# Altium project SAMV71_Xplained_Ultra.PrjPCB (part 1 of 4)
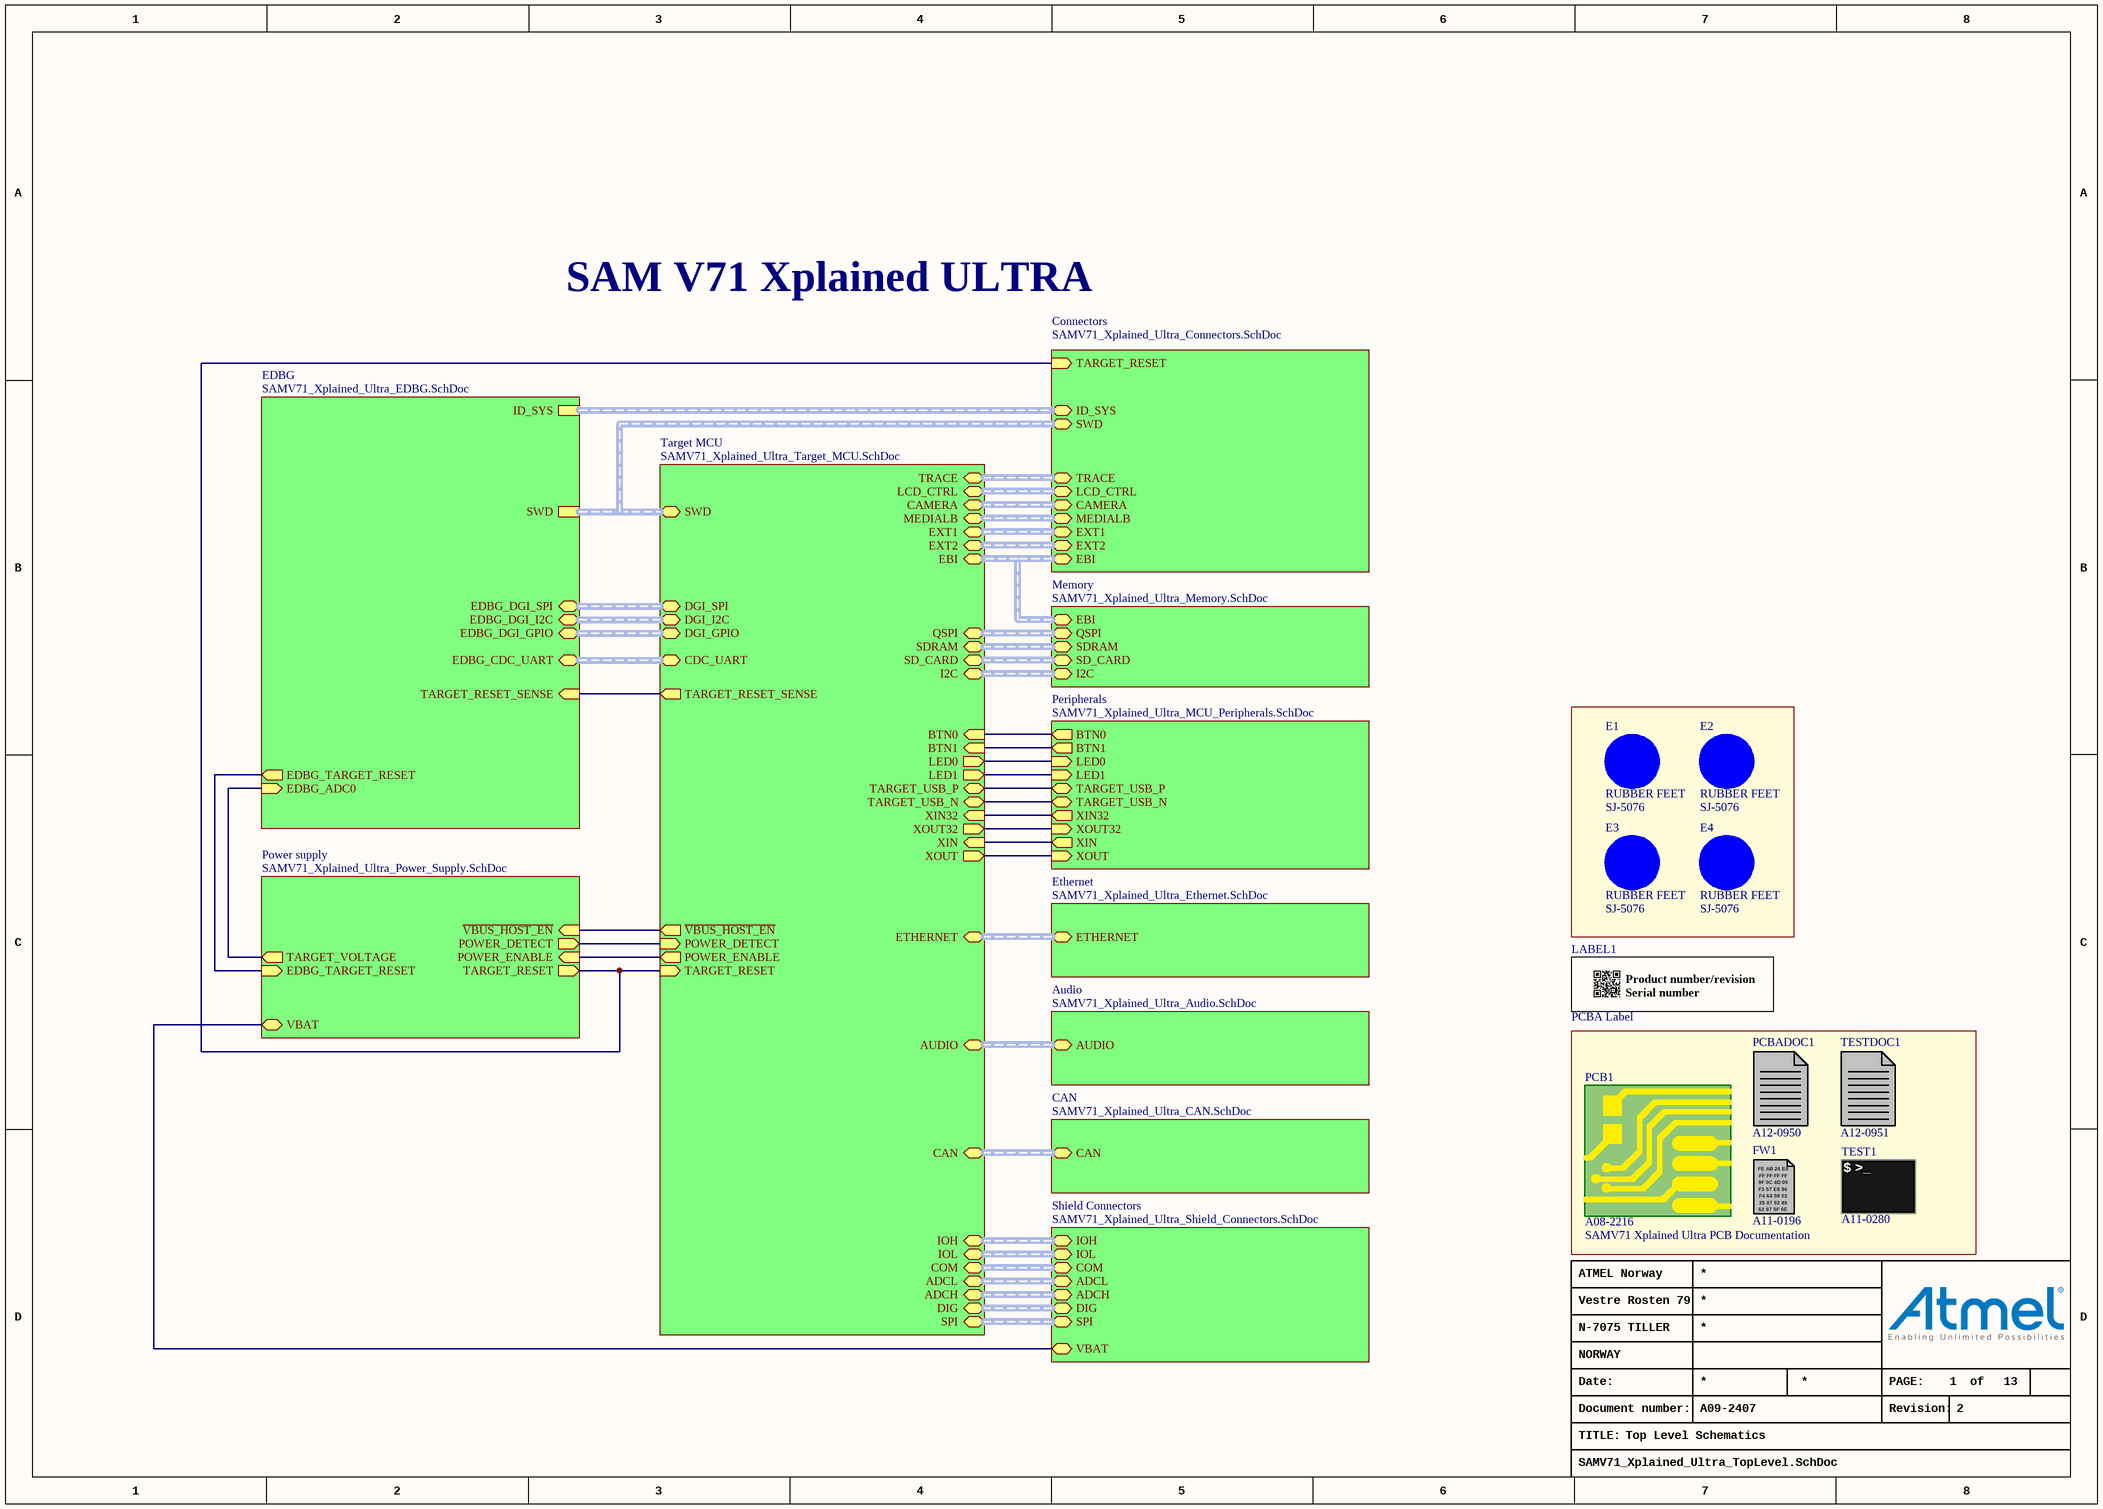
[diagram p0: SAMV71_Xplained_Ultra_TopLevel.SchDoc]
13 sheets, 396 parts. Net scope: hierarchical (ports join the sheet entries above them; power ports are global).
Board file: SAMV71_Xplained_Ultra.PcbDoc
Sheets:
  SAMV71_Xplained_Ultra_TopLevel.SchDoc
    Target MCU = SAMV71_Xplained_Ultra_Target_MCU.SchDoc
    EDBG = SAMV71_Xplained_Ultra_EDBG.SchDoc
    Connectors = SAMV71_Xplained_Ultra_Connectors.SchDoc
    Power supply = SAMV71_Xplained_Ultra_Power_Supply.SchDoc
      Power Multiplexer = SAMV71_Xplained_Ultra_Power_Multiplexer.SchDoc
      Power Converter = SAMV71_Xplained_Ultra_Power_Converter.SchDoc
    Ethernet = SAMV71_Xplained_Ultra_Ethernet.SchDoc
    Memory = SAMV71_Xplained_Ultra_Memory.SchDoc
    Shield Connectors = SAMV71_Xplained_Ultra_Shield_Connectors.SchDoc
    Audio = SAMV71_Xplained_Ultra_Audio.SchDoc
    Peripherals = SAMV71_Xplained_Ultra_MCU_Peripherals.SchDoc
    CAN = SAMV71_Xplained_Ultra_CAN.SchDoc

## Sheet SAMV71_Xplained_Ultra_TopLevel.SchDoc: Top Level Schematics
size A3; Organization: ATMEL Norway; Address1: Vestre Rosten 79; Address2: N-7075 TILLER; Address3: NORWAY; DocumentNumber: A09-2407; Revision: 2; SheetNumber: 1; SheetTotal: 13; PageSetup: Record=PageOptions|CenterHorizontal=True|CenterVertical=True|PrintScale=1.01|XCorrection=1.00|YCorrection=1.00|PrintKind=1|BorderSize=5000000|LeftOffset=0|BottomOffset=0|Orientation=2|PaperLength=1000|PaperWidth=1000|Scale=100|PaperSource=7|PrintQuality=-4|MediaType=1|DitherType=10|PaperKind=Letter|PrintScaleMode=1

### Parts
E1  RUBBER FEET  value SJ-5076  [AP8-00192]
E2  RUBBER FEET  value SJ-5076  [AP8-00192]
E3  RUBBER FEET  value SJ-5076  [AP8-00192]
E4  RUBBER FEET  value SJ-5076  [AP8-00192]
FW1  AN: A11-0196  (hidden comment: FW)  (mechanical)
LABEL1  value PCBA Label  [AP8-00317]
PCB1  value SAMV71 Xplained Ultra PCB Documentation  AN: A08-2216  (hidden comment: PCB)  (mechanical)
PCBADOC1  AN: A12-0950  (hidden comment: PCBADOC)  (mechanical)
TEST1  AN: A11-0280  (hidden comment: TEST)  (mechanical)
TESTDOC1  AN: A12-0951  (hidden comment: TESTDOC)  (mechanical)

### Sub-sheets
Audio = SAMV71_Xplained_Ultra_Audio.SchDoc: AUDIO (harness AUDIO)
CAN = SAMV71_Xplained_Ultra_CAN.SchDoc: CAN (harness CAN)
Connectors = SAMV71_Xplained_Ultra_Connectors.SchDoc: ID_SYS (harness ID_SYS), EXT1 (harness EXT1), EXT2 (harness EXT2), EBI (harness EBI), CAMERA (harness CAMERA), MEDIALB (harness MEDIALB), TRACE (harness TRACE), LCD_CTRL (harness LCD_CTRL), SWD (harness SWD), TARGET_RESET (in)
EDBG = SAMV71_Xplained_Ultra_EDBG.SchDoc: ID_SYS (harness ID_SYS), SWD (harness SWD), EDBG_CDC_UART (harness CDC_UART), EDBG_DGI_I2C (harness DGI_I2C), EDBG_DGI_SPI (harness DGI_SPI), EDBG_DGI_GPIO (harness DGI_GPIO), TARGET_RESET_SENSE (in), EDBG_ADC0 (in), EDBG_TARGET_RESET (out)
Ethernet = SAMV71_Xplained_Ultra_Ethernet.SchDoc: ETHERNET (harness ETHERNET)
Memory = SAMV71_Xplained_Ultra_Memory.SchDoc: SD_CARD (harness SD_CARD), EBI (harness EBI), QSPI (harness QSPI), SDRAM (harness SDRAM), I2C (harness I2C)
Peripherals = SAMV71_Xplained_Ultra_MCU_Peripherals.SchDoc: BTN0 (out), BTN1 (out), LED0 (in), TARGET_USB_N (bidir), TARGET_USB_P (bidir), XOUT32 (in), XIN32 (out), XIN (out), XOUT (in), LED1 (in)
Power supply = SAMV71_Xplained_Ultra_Power_Supply.SchDoc: TARGET_VOLTAGE (out), ~{VBUS_HOST_EN} (in), EDBG_TARGET_RESET (in), POWER_ENABLE (in), TARGET_RESET (out), POWER_DETECT (out), VBAT (bidir)
Shield Connectors = SAMV71_Xplained_Ultra_Shield_Connectors.SchDoc: IOH (harness IOH), IOL (harness IOL), COM (harness COM), ADCL (harness ADCL), ADCH (harness ADCH), DIG (harness DIG), SPI (harness SPI), VBAT (bidir)
Target MCU = SAMV71_Xplained_Ultra_Target_MCU.SchDoc: SWD (harness SWD), DGI_SPI (harness DGI_SPI), DGI_I2C (harness DGI_I2C), DGI_GPIO (harness DGI_GPIO), CDC_UART (harness CDC_UART), TARGET_RESET_SENSE (out), SD_CARD (harness SD_CARD), QSPI (harness QSPI), SDRAM (harness SDRAM), ETHERNET (harness ETHERNET), EXT2 (harness EXT2), EXT1 (harness EXT1), EBI (harness EBI), CAMERA (harness CAMERA), AUDIO (harness AUDIO), BTN0 (in), BTN1 (in), LED0 (out), TARGET_USB_P (bidir), XOUT32 (out), XIN32 (in), XIN (in), XOUT (out), LED1 (out), TARGET_USB_N (bidir), IOH (harness IOH), IOL (harness IOL), COM (harness COM), ADCL (harness ADCL), ADCH (harness ADCH), DIG (harness DIG), CAN (harness CAN), ~{VBUS_HOST_EN} (out), I2C (harness I2C), TARGET_RESET (in), POWER_ENABLE (out), TRACE (harness TRACE), LCD_CTRL (harness LCD_CTRL), MEDIALB (harness MEDIALB), SPI (harness SPI), POWER_DETECT (in)

### Nets
EDBG_ADC0: sheet EDBG/EDBG_ADC0, sheet Power supply/TARGET_VOLTAGE
EDBG_TARGET_RESET: sheet EDBG/EDBG_TARGET_RESET, sheet Power supply/EDBG_TARGET_RESET
PA01: sheet Target MCU/POWER_DETECT, sheet Power supply/POWER_DETECT
PA07_XIN32: sheet Target MCU/XIN32, sheet Peripherals/XIN32
PA08_XOUT32: sheet Target MCU/XOUT32, sheet Peripherals/XOUT32
PA09: sheet Target MCU/BTN0, sheet Peripherals/BTN0
PA23: sheet Target MCU/LED0, sheet Peripherals/LED0
PB08_XOUT: sheet Target MCU/XOUT, sheet Peripherals/XOUT
PB09_XIN: sheet Target MCU/XIN, sheet Peripherals/XIN
PB12: sheet Target MCU/BTN1, sheet Peripherals/BTN1
PC09: sheet Target MCU/LED1, sheet Peripherals/LED1
PC16: sheet Target MCU/~{VBUS_HOST_EN}, sheet Power supply/~{VBUS_HOST_EN}
PC17: sheet Target MCU/POWER_ENABLE, sheet Power supply/POWER_ENABLE
TARGET_RESET: sheet Target MCU/TARGET_RESET_SENSE, sheet Target MCU/TARGET_RESET, sheet EDBG/TARGET_RESET_SENSE, sheet Connectors/TARGET_RESET, sheet Power supply/TARGET_RESET
TARGET_USB_N: sheet Target MCU/TARGET_USB_N, sheet Peripherals/TARGET_USB_N
TARGET_USB_P: sheet Target MCU/TARGET_USB_P, sheet Peripherals/TARGET_USB_P
VBAT: sheet Power supply/VBAT, sheet Shield Connectors/VBAT

Not connected (* = marked no-connect by the designer): E1 1(FIDUCIAL); E2 1(FIDUCIAL); E3 1(FIDUCIAL); E4 1(FIDUCIAL)

### Buses and harness runs
harness sheet Audio/AUDIO = sheet Target MCU/AUDIO
harness sheet CAN/CAN = sheet Target MCU/CAN
harness sheet Connectors/CAMERA = sheet Target MCU/CAMERA
harness sheet Connectors/EBI = sheet Memory/EBI = sheet Target MCU/EBI
harness sheet Connectors/EXT1 = sheet Target MCU/EXT1
harness sheet Connectors/EXT2 = sheet Target MCU/EXT2
harness sheet Connectors/ID_SYS = sheet EDBG/ID_SYS
harness sheet Connectors/LCD_CTRL = sheet Target MCU/LCD_CTRL
harness sheet Connectors/MEDIALB = sheet Target MCU/MEDIALB
harness sheet Connectors/SWD = sheet EDBG/SWD = sheet Target MCU/SWD
harness sheet Connectors/TRACE = sheet Target MCU/TRACE
harness sheet EDBG/EDBG_CDC_UART = sheet Target MCU/CDC_UART
harness sheet EDBG/EDBG_DGI_GPIO = sheet Target MCU/DGI_GPIO
harness sheet EDBG/EDBG_DGI_I2C = sheet Target MCU/DGI_I2C
harness sheet EDBG/EDBG_DGI_SPI = sheet Target MCU/DGI_SPI
harness sheet Ethernet/ETHERNET = sheet Target MCU/ETHERNET
harness sheet Memory/I2C = sheet Target MCU/I2C
harness sheet Memory/QSPI = sheet Target MCU/QSPI
harness sheet Memory/SD_CARD = sheet Target MCU/SD_CARD
harness sheet Memory/SDRAM = sheet Target MCU/SDRAM
harness sheet Shield Connectors/ADCH = sheet Target MCU/ADCH
harness sheet Shield Connectors/ADCL = sheet Target MCU/ADCL
harness sheet Shield Connectors/COM = sheet Target MCU/COM
harness sheet Shield Connectors/DIG = sheet Target MCU/DIG
harness sheet Shield Connectors/IOH = sheet Target MCU/IOH
harness sheet Shield Connectors/IOL = sheet Target MCU/IOL
harness sheet Shield Connectors/SPI = sheet Target MCU/SPI

### Notes on the sheet
- SAM V71 Xplained ULTRA
- Date:
- PAGE:
- of
- TITLE:
- Document number:
- Revision:
- (in symbol A09-0611) / Product number/revision / Serial number
- (in symbol A11-0196) FE AB 26 E0; FF FF FF FF; 9F 0C 4D 00; F3 57 E8 96; F4 64 98 02; 35 07 92 86; 62 87 5F 0E
- (in symbol A11-0280) $ >_

### Library data of the parts
E1-E4 = A08-0053: 2.8mm adhesive feet,diam 8.0mm; PartGroup: Mechanical devices,Mounting accessories; Manufacturer: 3M; AN: A08-0053; Height: 2,79999995231628; MPN: SJ-5076
FW1 = A11-0196: EDBG secured firmware; PartGroup: Software,Firmware,Tools; Manufacturer: ATMEL; Value: EDBG secured firmware
LABEL1 = A09-0611: PCBA identification label PP Top White Gloss; PartGroup: Mechanical devices,Packaging materials,Printed Labels; Manufacturer: ACT Logimark AS; MPN: 505462; AN: A09-0611
PCB1 = A08-2216: SAMV7 Xplained Ultra PCB Documentation; PartGroup: Mechanical devices,Printed circuit boards
PCBADOC1 = A12-0950: SAMV7 Xplained pro PCBA Documentation; PartGroup: Documentation,PCBA Documents,Atmel; Value: SAMV7 Xplained pro PCBA Documentation
TEST1 = A11-0280: Fixture eggTest for SAMV7 Xplained Ultra; PartGroup: Software,Test software,Starter Kit; Value: SAMV7 Xplained Ultra Test
TESTDOC1 = A12-0951: SAMV7 Xplained Pro Test Instructions; PartGroup: Documentation,Procedures,Test Instructions; Value: SAMV7 Xplained Pro Test Instructions

## Sheet SAMV71_Xplained_Ultra_Target_MCU.SchDoc: Target MCU
size A3; Organization: ATMEL Norway; Address1: Vestre Rosten 79; Address2: N-7075 TILLER; Address3: NORWAY; DocumentNumber: A09-2407; Revision: 2; SheetNumber: 5; SheetTotal: 13; PageSetup: Record=PageOptions|CenterHorizontal=True|CenterVertical=True|PrintScale=1.01|XCorrection=1.00|YCorrection=1.00|PrintKind=1|BorderSize=5000000|LeftOffset=0|BottomOffset=0|Orientation=2|PaperLength=1000|PaperWidth=1000|Scale=100|PaperSource=7|PrintQuality=-4|MediaType=1|DitherType=10|PaperKind=A3 (297 x 420 mm)|PrintScaleMode=1
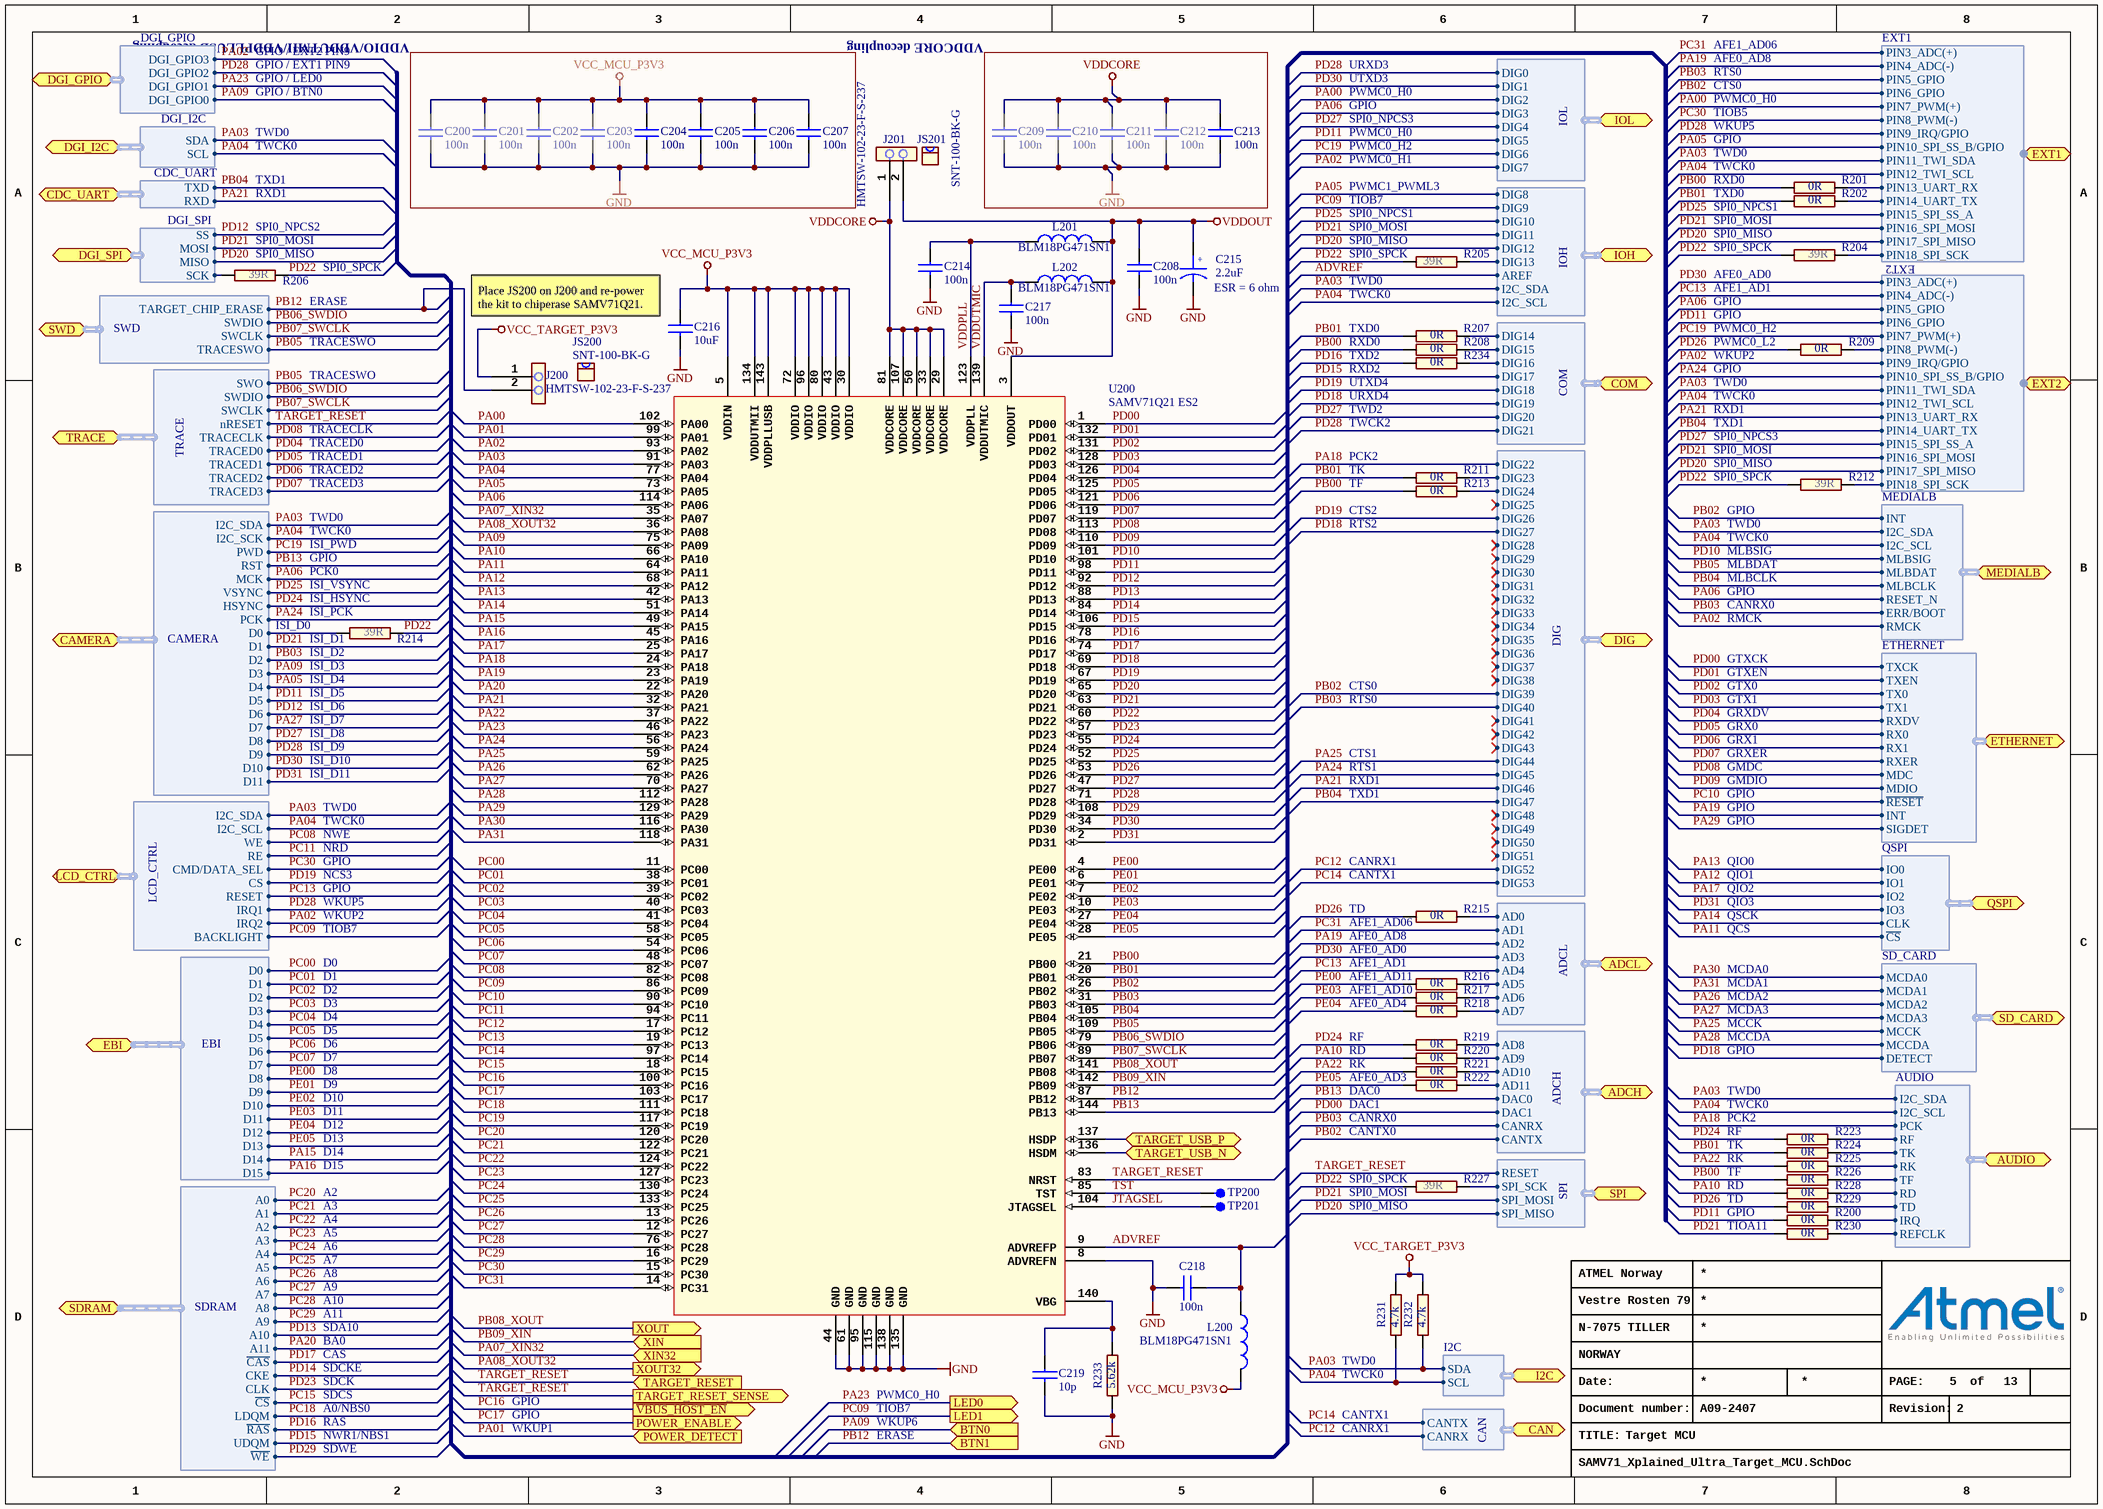
[diagram p1: SAMV71_Xplained_Ultra_Target_MCU.SchDoc]

### Parts
C200  value 100n  [AP1-00001]  (hidden comment: CAP-NONPOL)
C201  value 100n  [AP1-00001]  (hidden comment: CAP-NONPOL)
C202  value 100n  [AP1-00001]  (hidden comment: CAP-NONPOL)
C203  value 100n  [AP1-00001]  (hidden comment: CAP-NONPOL)
C204  value 100n  [AP1-00001]  (hidden comment: CAP-NONPOL)
C205  value 100n  [AP1-00001]  (hidden comment: CAP-NONPOL)
C206  value 100n  [AP1-00001]  (hidden comment: CAP-NONPOL)
C207  value 100n  [AP1-00001]  (hidden comment: CAP-NONPOL)
C208  value 100n  [AP1-00001]  (hidden comment: CAP-NONPOL)
C209  value 100n  [AP1-00001]  (hidden comment: CAP-NONPOL)
C210  value 100n  [AP1-00001]  (hidden comment: CAP-NONPOL)
C211  value 100n  [AP1-00001]  (hidden comment: CAP-NONPOL)
C212  value 100n  [AP1-00001]  (hidden comment: CAP-NONPOL)
C213  value 100n  [AP1-00001]  (hidden comment: CAP-NONPOL)
C214  value 100n  [AP1-00001]  (hidden comment: CAP-NONPOL)
C215  ESR = 6 ohm  value 2.2uF  [AP1-00036]
C216  value 10uF  [AP1-00041]  (hidden comment: CAP-NONPOL)
C217  value 100n  [AP1-00001]  (hidden comment: CAP-NONPOL)
C218  value 100n  [AP1-00001]  (hidden comment: CAP-NONPOL)
C219  10p  [AP1-00053]
J200  value HMTSW-102-23-F-S-237  [AP8-00733]  (hidden comment: HEADER 1x2)
J201  value HMTSW-102-23-F-S-237  [AP8-00733]  (hidden comment: HEADER 1x2)
JS200  value SNT-100-BK-G  [AP8-00525]
JS201  value SNT-100-BK-G  [AP8-00525]
L200  value BLM18PG471SN1  [AP3-00005]  (hidden comment: INDUCTOR)
L201  value BLM18PG471SN1  [AP3-00005]  (hidden comment: INDUCTOR)
L202  value BLM18PG471SN1  [AP3-00005]  (hidden comment: INDUCTOR)
R200  value 0R  [AP2-00000]  (hidden comment: R2)
R201  value 0R  [AP2-00000]  (hidden comment: R2)
R202  value 0R  [AP2-00000]  (hidden comment: R2)
R204  value 39R  [AP2-00000]  (hidden comment: R2)
R205  value 39R  [AP2-00000]  (hidden comment: R2)
R206  value 39R  [AP2-00000]  (hidden comment: R2)
R207  value 0R  [AP2-00000]  (hidden comment: R2)
R208  value 0R  [AP2-00000]  (hidden comment: R2)
R209  value 0R  [AP2-00000]  (hidden comment: R2)
R211  value 0R  [AP2-00000]  (hidden comment: R2)
R212  value 39R  [AP2-00000]  (hidden comment: R2)
R213  value 0R  [AP2-00000]  (hidden comment: R2)
R214  value 39R  [AP2-00000]  (hidden comment: R2)
R215  value 0R  [AP2-00000]  (hidden comment: R2)
R216  value 0R  [AP2-00000]  (hidden comment: R2)
R217  value 0R  [AP2-00000]  (hidden comment: R2)
R218  value 0R  [AP2-00000]  (hidden comment: R2)
R219  value 0R  [AP2-00000]  (hidden comment: R2)
R220  value 0R  [AP2-00000]  (hidden comment: R2)
R221  value 0R  [AP2-00000]  (hidden comment: R2)
R222  value 0R  [AP2-00000]  (hidden comment: R2)
R223  value 0R  [AP2-00000]  (hidden comment: R2)
R224  value 0R  [AP2-00000]  (hidden comment: R2)
R225  value 0R  [AP2-00000]  (hidden comment: R2)
R226  value 0R  [AP2-00000]  (hidden comment: R2)
R227  value 39R  [AP2-00000]  (hidden comment: R2)
R228  value 0R  [AP2-00000]  (hidden comment: R2)
R229  value 0R  [AP2-00000]  (hidden comment: R2)
R230  value 0R  [AP2-00000]  (hidden comment: R2)
R231  value 4.7k  [AP2-00000]  (hidden comment: R2)
R232  value 4.7k  [AP2-00000]  (hidden comment: R2)
R233  value 5.62k  [AP2-00000]  (hidden comment: R2)
R234  value 0R  [AP2-00000]  (hidden comment: R2)
TP200  TESTPOINT  [AP8-00010]  (value not drawn)  (no BOM)
TP201  TESTPOINT  [AP8-00010]  (value not drawn)  (no BOM)
U200  value SAMV71Q21 ES2  [AP6-00118]

### Blocks framed on the sheet
VDDIO/VDDUTMII/VDDPLLUSB decoupling: C200-C207
VDDCORE decoupling: C209-C213

### Ports
ADCH (harness ADCH), ADCL (harness ADCL), AUDIO (harness AUDIO), BTN0 (in), BTN1 (in), CAMERA (harness CAMERA), CAN (harness CAN), CDC_UART (harness CDC_UART), COM (harness COM), DGI_GPIO (harness DGI_GPIO), DGI_I2C (harness DGI_I2C), DGI_SPI (harness DGI_SPI), DIG (harness DIG), EBI (harness EBI), ETHERNET (harness ETHERNET), EXT1 (harness EXT1), EXT2 (harness EXT2), I2C (harness I2C), IOH (harness IOH), IOL (harness IOL), LCD_CTRL (harness LCD_CTRL), LED0 (out), LED1 (out), MEDIALB (harness MEDIALB), POWER_DETECT (in), POWER_ENABLE (out), QSPI (harness QSPI), SD_CARD (harness SD_CARD), SDRAM (harness SDRAM), SPI (harness SPI), SWD (harness SWD), TARGET_RESET (in), TARGET_RESET_SENSE (out), TARGET_USB_N (bidir), TARGET_USB_P (bidir), TRACE (harness TRACE), XIN32 (in), XIN (in), XOUT32 (out), XOUT (out), ~{VBUS_HOST_EN} (out)

### Harnesses
SWD: SWCLK, SWDIO, TARGET_CHIP_ERASE, TRACESWO
DGI_GPIO: DGI_GPIO0, DGI_GPIO1, DGI_GPIO2, DGI_GPIO3
DGI_SPI: MISO, MOSI, SCK, SS
DGI_I2C: SCL, SDA
CDC_UART: RXD, TXD
EXT1: PIN10_SPI_SS_B/GPIO, PIN11_TWI_SDA, PIN12_TWI_SCL, PIN13_UART_RX, PIN14_UART_TX, PIN15_SPI_SS_A, PIN16_SPI_MOSI, PIN17_SPI_MISO, PIN18_SPI_SCK, PIN3_ADC(+), PIN4_ADC(-), PIN5_GPIO, PIN6_GPIO, PIN7_PWM(+), PIN8_PWM(-), PIN9_IRQ/GPIO
EXT2: PIN10_SPI_SS_B/GPIO, PIN11_TWI_SDA, PIN12_TWI_SCL, PIN13_UART_RX, PIN14_UART_TX, PIN15_SPI_SS_A, PIN16_SPI_MOSI, PIN17_SPI_MISO, PIN18_SPI_SCK, PIN3_ADC(+), PIN4_ADC(-), PIN5_GPIO, PIN6_GPIO, PIN7_PWM(+), PIN8_PWM(-), PIN9_IRQ/GPIO
EBI: D0, D1, D2, D3, D4, D5, D6, D7, D8, D9, D10, D11, D12, D13, D14, D15
CAMERA: MCK, VSYNC, HSYNC, PCK, D0, D1, D2, D3, D4, D5, D6, D7, D8, D9, D10, D11, I2C_SCK, I2C_SDA, RST, PWD
ETHERNET: TX0, TX1, TXEN, TXCK, RX0, RX1, MDC, MDIO, RXER, RXDV, INT, ~{RESET}, SIGDET
QSPI: CLK, IO3, IO2, IO0, IO1, ~{CS}
SDRAM: ~{CAS}, ~{RAS}, ~{CS}, CLK, CKE, ~{WE}, LDQM, UDQM, A0, A1, A2, A3, A4, A5, A6, A7, A8, A9, A10, A11
SD_CARD: MCCDA, MCCK, MCDA3, MCDA2, MCDA1, MCDA0, DETECT
AUDIO: I2C_SDA, I2C_SCL, PCK, TK, RK, TF, RD, TD, IRQ, REFCLK, RF
ADCL: AD0, AD1, AD2, AD3, AD4, AD5, AD6, AD7
ADCH: AD8, AD9, AD10, AD11, DAC0, DAC1, CANRX, CANTX
DIG: DIG22, DIG23, DIG24, DIG25, DIG26, DIG27, DIG28, DIG29, DIG30, DIG31, DIG32, DIG33, DIG34, DIG35, DIG36, DIG37, DIG38, DIG39, DIG40, DIG41, DIG42, DIG43, DIG44, DIG45, DIG46, DIG47, DIG48, DIG49, DIG50, DIG51, DIG52, DIG53
CAN: CANTX, CANRX
I2C: SDA, SCL
LCD_CTRL: CMD/DATA_SEL, CS, WE, RE, I2C_SDA, I2C_SCL, IRQ1, IRQ2, BACKLIGHT, RESET
SPI: SPI_MISO, SPI_MOSI, SPI_SCK, RESET
TRACE: SWDIO, SWCLK, TRACECLK, TRACED0, TRACED1, TRACED2, TRACED3, nRESET, SWO
MEDIALB: MLBSIG, MLBDAT, MLBCLK, I2C_SDA, I2C_SCL, INT, ERR/BOOT, RESET_N, RMCK
COM: DIG14, DIG15, DIG16, DIG17, DIG18, DIG19, DIG20, DIG21
IOH: DIG8, DIG9, DIG10, DIG11, DIG12, DIG13, AREF, I2C_SCL, I2C_SDA
IOL: DIG0, DIG1, DIG2, DIG3, DIG4, DIG5, DIG6, DIG7

### Nets
GND: C200.2 C201.2 C202.2 C203.2 C204.2 C205.2 C206.2 C207.2 C208.2 C209.2 C210.2 C211.2 C212.2 C213.2 C214.2 C215.2 C216.2 C217.2 C218.2 C219.2 R233.1 U200.8(ADVREFN) U200.44(GND) U200.61(GND) U200.95(GND) U200.115(GND) U200.135(GND) U200.138(GND)
VCC_MCU_P3V3: C200.1 C201.1 C202.1 C203.1 C204.1 C205.1 C206.1 C207.1 C216.1 L200.1 U200.5(VDDIN) U200.30(VDDIO) U200.43(VDDIO) U200.72(VDDIO) U200.80(VDDIO) U200.96(VDDIO) U200.134(VDDUTMII) U200.143(VDDPLLUSB)
VCC_TARGET_P3V3: J200.1 R231.1 R232.1
VDDCORE: C209.1 C210.1 C211.1 C212.1 C213.1 J201.1 U200.29(VDDCORE) U200.33(VDDCORE) U200.50(VDDCORE) U200.81(VDDCORE) U200.107(VDDCORE)
VDDOUT: C208.1 C215.1 J201.2 L201.1 L202.1 U200.3(VDDOUT)
ADVREF: C218.1 L200.2 U200.9(ADVREFP) ; port IOH.AREF
JTAGSEL: TP201.1 U200.104(JTAGSEL)
PA00: U200.102(PA00) ; port EXT1.PIN7_PWM(+), port IOL.DIG2
PA01: U200.99(PA01) ; port POWER_DETECT
PA02: U200.93(PA02) ; port DGI_GPIO.DGI_GPIO3, port EXT2.PIN9_IRQ/GPIO, port LCD_CTRL.IRQ2, port MEDIALB.RMCK, port IOL.DIG7
PA03: R232.2 U200.91(PA03) ; port DGI_I2C.SDA, port EXT1.PIN11_TWI_SDA, port EXT2.PIN11_TWI_SDA, port CAMERA.I2C_SDA, port AUDIO.I2C_SDA, port I2C.SDA, port LCD_CTRL.I2C_SDA, port MEDIALB.I2C_SDA, port IOH.I2C_SDA
PA04: R231.2 U200.77(PA04) ; port DGI_I2C.SCL, port EXT1.PIN12_TWI_SCL, port EXT2.PIN12_TWI_SCL, port CAMERA.I2C_SCK, port AUDIO.I2C_SCL, port I2C.SCL, port LCD_CTRL.I2C_SCL, port MEDIALB.I2C_SCL, port IOH.I2C_SCL
PA05: U200.73(PA05) ; port EXT1.PIN10_SPI_SS_B/GPIO, port CAMERA.D4, port IOH.DIG8
PA06: U200.114(PA06) ; port EXT2.PIN5_GPIO, port CAMERA.MCK, port MEDIALB.RESET_N, port IOL.DIG3
PA07_XIN32: U200.35(PA07) ; port XIN32
PA08_XOUT32: U200.36(PA08) ; port XOUT32
PA09: U200.75(PA09) ; port BTN0, port DGI_GPIO.DGI_GPIO0, port CAMERA.D3
PA10: R220.1 R228.1 U200.66(PA10)
PA11: U200.64(PA11) ; port QSPI.~{CS}
PA12: U200.68(PA12) ; port QSPI.IO1
PA13: U200.42(PA13) ; port QSPI.IO0
PA14: U200.51(PA14) ; port QSPI.CLK
PA15: U200.49(PA15) ; port EBI.D14
PA16: U200.45(PA16) ; port EBI.D15
PA17: U200.25(PA17) ; port QSPI.IO2
PA18: U200.24(PA18) ; port AUDIO.PCK, port DIG.DIG22
PA19: U200.23(PA19) ; port EXT1.PIN4_ADC(-), port ETHERNET.INT, port ADCL.AD2
PA20: U200.22(PA20) ; port SDRAM.A11
PA21: U200.32(PA21) ; port CDC_UART.RXD, port EXT2.PIN13_UART_RX, port DIG.DIG46
PA22: R221.1 R225.1 U200.37(PA22)
PA23: U200.46(PA23) ; port LED0, port DGI_GPIO.DGI_GPIO1
PA24: U200.56(PA24) ; port EXT2.PIN10_SPI_SS_B/GPIO, port CAMERA.PCK, port DIG.DIG45
PA25: U200.59(PA25) ; port SD_CARD.MCCK, port DIG.DIG44
PA26: U200.62(PA26) ; port SD_CARD.MCDA2
PA27: U200.70(PA27) ; port CAMERA.D7, port SD_CARD.MCDA3
PA28: U200.112(PA28) ; port SD_CARD.MCCDA
PA29: U200.129(PA29) ; port ETHERNET.SIGDET
PA30: U200.116(PA30) ; port SD_CARD.MCDA0
PA31: U200.118(PA31) ; port SD_CARD.MCDA1
PB00: R201.1 R208.1 R213.1 R226.1 U200.21(PB00)
PB01: R202.1 R207.1 R211.1 R224.1 U200.20(PB01)
PB02: U200.26(PB02) ; port EXT1.PIN6_GPIO, port ADCH.CANTX, port DIG.DIG39, port MEDIALB.INT
PB03: U200.31(PB03) ; port EXT1.PIN5_GPIO, port CAMERA.D2, port ADCH.CANRX, port DIG.DIG40, port MEDIALB.ERR/BOOT
PB04: U200.105(PB04) ; port CDC_UART.TXD, port EXT2.PIN14_UART_TX, port DIG.DIG47, port MEDIALB.MLBCLK
PB05: U200.109(PB05) ; port SWD.TRACESWO, port TRACE.SWO, port MEDIALB.MLBDAT
PB06_SWDIO: U200.79(PB06) ; port SWD.SWDIO, port TRACE.SWDIO
PB07_SWCLK: U200.89(PB07) ; port SWD.SWCLK, port TRACE.SWCLK
PB08_XOUT: U200.141(PB08) ; port XOUT
PB09_XIN: U200.142(PB09) ; port XIN
PB12: J200.2 U200.87(PB12) ; port BTN1, port SWD.TARGET_CHIP_ERASE
PB13: U200.144(PB13) ; port CAMERA.RST, port ADCH.DAC0
PC00: U200.11(PC00) ; port EBI.D0
PC01: U200.38(PC01) ; port EBI.D1
PC02: U200.39(PC02) ; port EBI.D2
PC03: U200.40(PC03) ; port EBI.D3
PC04: U200.41(PC04) ; port EBI.D4
PC05: U200.58(PC05) ; port EBI.D5
PC06: U200.54(PC06) ; port EBI.D6
PC07: U200.48(PC07) ; port EBI.D7
PC08: U200.82(PC08) ; port LCD_CTRL.WE
PC09: U200.86(PC09) ; port LED1, port LCD_CTRL.BACKLIGHT, port IOH.DIG9
PC10: U200.90(PC10) ; port ETHERNET.~{RESET}  [project net ~{PHY_RESET}]
PC11: U200.94(PC11) ; port LCD_CTRL.RE
PC12: U200.17(PC12) ; port DIG.DIG52, port CAN.CANRX
PC13: U200.19(PC13) ; port EXT2.PIN4_ADC(-), port ADCL.AD4, port LCD_CTRL.RESET
PC14: U200.97(PC14) ; port DIG.DIG53, port CAN.CANTX
PC15: U200.18(PC15) ; port SDRAM.~{CS}
PC16: U200.100(PC16) ; port ~{VBUS_HOST_EN}
PC17: U200.103(PC17) ; port POWER_ENABLE
PC18: U200.111(PC18) ; port SDRAM.LDQM
PC19: U200.117(PC19) ; port EXT2.PIN7_PWM(+), port CAMERA.PWD, port IOL.DIG6
PC20: U200.120(PC20) ; port SDRAM.A0
PC21: U200.122(PC21) ; port SDRAM.A1
PC22: U200.124(PC22) ; port SDRAM.A2
PC23: U200.127(PC23) ; port SDRAM.A3
PC24: U200.130(PC24) ; port SDRAM.A4
PC25: U200.133(PC25) ; port SDRAM.A5
PC26: U200.13(PC26) ; port SDRAM.A6
PC27: U200.12(PC27) ; port SDRAM.A7
PC28: U200.76(PC28) ; port SDRAM.A8
PC29: U200.16(PC29) ; port SDRAM.A9
PC30: U200.15(PC30) ; port EXT1.PIN8_PWM(-), port LCD_CTRL.CMD/DATA_SEL
PC31: U200.14(PC31) ; port EXT1.PIN3_ADC(+), port ADCL.AD1
PD00: U200.1(PD00) ; port ETHERNET.TXCK, port ADCH.DAC1
PD01: U200.132(PD01) ; port ETHERNET.TXEN
PD02: U200.131(PD02) ; port ETHERNET.TX0
PD03: U200.128(PD03) ; port ETHERNET.TX1
PD04: U200.126(PD04) ; port ETHERNET.RXDV, port TRACE.TRACED0
PD05: U200.125(PD05) ; port ETHERNET.RX0, port TRACE.TRACED1
PD06: U200.121(PD06) ; port ETHERNET.RX1, port TRACE.TRACED2
PD07: U200.119(PD07) ; port ETHERNET.RXER, port TRACE.TRACED3
PD08: U200.113(PD08) ; port ETHERNET.MDC, port TRACE.TRACECLK
PD09: U200.110(PD09) ; port ETHERNET.MDIO
PD10: U200.101(PD10) ; port MEDIALB.MLBSIG
PD11: R200.1 U200.98(PD11) ; port EXT2.PIN6_GPIO, port CAMERA.D5, port IOL.DIG5
PD12: U200.92(PD12) ; port DGI_SPI.SS, port CAMERA.D6
PD13: U200.88(PD13) ; port SDRAM.A10
PD14: U200.84(PD14) ; port SDRAM.CKE
PD15: U200.106(PD15) ; port SDRAM.UDQM, port COM.DIG17
PD16: R234.1 U200.78(PD16) ; port SDRAM.~{RAS}
PD17: U200.74(PD17) ; port SDRAM.~{CAS}
PD18: U200.69(PD18) ; port SD_CARD.DETECT, port DIG.DIG27, port COM.DIG19
PD19: U200.67(PD19) ; port DIG.DIG26, port LCD_CTRL.CS, port COM.DIG18
PD20: U200.65(PD20) ; port DGI_SPI.MISO, port EXT1.PIN17_SPI_MISO, port EXT2.PIN17_SPI_MISO, port SPI.SPI_MISO, port IOH.DIG12
PD21: R230.1 U200.63(PD21) ; port DGI_SPI.MOSI, port EXT1.PIN16_SPI_MOSI, port EXT2.PIN16_SPI_MOSI, port CAMERA.D1, port SPI.SPI_MOSI, port IOH.DIG11
PD22: R204.1 R205.1 R206.2 R212.1 R214.2 R227.1 U200.60(PD22)
PD23: U200.57(PD23) ; port SDRAM.CLK
PD24: R219.1 R223.1 U200.55(PD24) ; port CAMERA.HSYNC
PD25: U200.52(PD25) ; port EXT1.PIN15_SPI_SS_A, port CAMERA.VSYNC, port IOH.DIG10
PD26: R209.1 R215.1 R229.1 U200.53(PD26)
PD27: U200.47(PD27) ; port EXT2.PIN15_SPI_SS_A, port CAMERA.D8, port COM.DIG20, port IOL.DIG4
PD28: U200.71(PD28) ; port DGI_GPIO.DGI_GPIO2, port EXT1.PIN9_IRQ/GPIO, port CAMERA.D9, port LCD_CTRL.IRQ1, port COM.DIG21, port IOL.DIG0
PD29: U200.108(PD29) ; port SDRAM.~{WE}
PD30: U200.34(PD30) ; port EXT2.PIN3_ADC(+), port CAMERA.D10, port ADCL.AD3, port IOL.DIG1
PD31: U200.2(PD31) ; port CAMERA.D11, port QSPI.IO3
PE00: R216.1 U200.4(PE00) ; port EBI.D8
PE01: U200.6(PE01) ; port EBI.D9
PE02: U200.7(PE02) ; port EBI.D10
PE03: R217.1 U200.10(PE03) ; port EBI.D11
PE04: R218.1 U200.27(PE04) ; port EBI.D12
PE05: R222.1 U200.28(PE05) ; port EBI.D13
TARGET_RESET: U200.83(NRST) ; port TARGET_RESET_SENSE, port TARGET_RESET, port SPI.RESET, port TRACE.nRESET
TARGET_USB_N: U200.136(HSDM) ; port TARGET_USB_N
TARGET_USB_P: U200.137(HSDP) ; port TARGET_USB_P
TST: TP200.1 U200.85(TST)
VDDPLL: C214.1 L201.2 U200.123(VDDPLL)
VDDUTMIC: C217.1 L202.2 U200.139(VDDUTMIC)
NetC219_1: C219.1 R233.2 U200.140(VBG)
NetJ400_18: R214.1 ; port CAMERA.D0
NetJ401_13: R201.2 ; port EXT1.PIN13_UART_RX
NetJ401_14: R202.2 ; port EXT1.PIN14_UART_TX
NetJ401_18: R204.2 ; port EXT1.PIN18_SPI_SCK
NetJ402_8: R209.2 ; port EXT2.PIN8_PWM(-)
NetJ402_18: R212.2 ; port EXT2.PIN18_SPI_SCK
NetJ500_6: R205.2 ; port IOH.DIG13
NetJ502_1: R215.2 ; port ADCL.AD0
NetJ502_6: R216.2 ; port ADCL.AD5
NetJ502_7: R217.2 ; port ADCL.AD6
NetJ502_8: R218.2 ; port ADCL.AD7
NetJ504_1: R219.2 ; port ADCH.AD8
NetJ504_2: R220.2 ; port ADCH.AD9
NetJ504_3: R221.2 ; port ADCH.AD10
NetJ504_4: R222.2 ; port ADCH.AD11
NetJ505_6: R234.2 ; port COM.DIG16
NetJ505_7: R208.2 ; port COM.DIG15
NetJ505_8: R207.2 ; port COM.DIG14
NetJ506_3: R227.2 ; port SPI.SPI_SCK
NetJ507_4: R211.2 ; port DIG.DIG23
NetJ507_5: R213.2 ; port DIG.DIG24
NetR200_2: R200.2 ; port AUDIO.IRQ
NetR206_1: R206.1 ; port DGI_SPI.SCK
NetR223_2: R223.2 R226.2 ; port AUDIO.TF, port AUDIO.RF
NetR224_2: R224.2 ; port AUDIO.TK
NetR225_2: R225.2 ; port AUDIO.RK
NetR228_2: R228.2 ; port AUDIO.RD
NetR229_2: R229.2 ; port AUDIO.TD
NetR230_2: R230.2 ; port AUDIO.REFCLK

### Notes on the sheet
- AFE1_AD06
- GPIO / BTN0
- GPIO / LED0
- GPIO / EXT2 PIN9
- GPIO / EXT1 PIN9
- PWMC0_H0
- GPIO
- URXD3
- UTXD3
- RTS0
- CTS0
- AFE0_AD8
- TWCK0
- TWD0
- TXD1
- SPI0_NPCS3
- PWMC0_H2
- PWMC0_H1
- TIOB5
- RXD0
- WKUP5
- (near R206) SPI0_MOSI
- (near R206) SPI0_NPCS2
- RXD1
- (near R205) SPI0_MOSI
- (near R205) SPI0_MISO
- (near R205) SPI0_NPCS1
- PWMC1_PWML3
- TIOB7
- TXD0
- SPI0_NPCS1
- SPI0_MOSI
- SPI0_MISO
- (near R206) SPI0_MISO
- (near R206) ERASE
- (near R206) SPI0_SPCK
- (near C216) Place JS200 on J200 and re-power the kit to chiperase SAMV71Q21.
- (near R205) SPI0_SPCK
- (near R204) SPI0_SPCK
- AFE1_AD1
- (near R204) AFE0_AD0
- TRACESWO
- TXD2
- RXD2
- (near R209) PWMC0_H2
- (near R209) PWMC0_L2
- WKUP2
- TRACECLK
- TRACED0
- UTXD4
- URXD4
- TWD2
- TWCK2
- (near R212) SPI0_MOSI
- (near R212) SPI0_NPCS3
- TRACED1
- TRACED2
- TRACED3
- PCK2
- TK
- TF
- CTS2
- (near R212) SPI0_MISO
- (near R212) SPI0_SPCK
- (near R212) GPIO
- ISI_PWD
- PCK0
- (near R214) ISI_VSYNC
- RTS2
- MLBSIG
- MLBDAT
- MLBCLK
- (near R214) ISI_D0
- (near R214) ISI_PCK
- (near R214) ISI_HSYNC
- (near R214) ISI_D1
- RMCK
- CANRX0
- (near R214) ISI_D2
- (near R214) ISI_D3
- (near R214) ISI_D4
- ISI_D5
- ISI_D6
- ISI_D7
- GTXCK
- GTXEN
- GTX0
- GTX1
- GRXDV
- ISI_D8
- ISI_D9
- ISI_D10
- ISI_D11
- CTS1
- RTS1
- GRX0
- GRX1
- GRXER
- GMDC
- GMDIO
- NWE
- NRD
- NCS3
- TD
- (near R215) CANTX1
- CANRX1
- QIO0
- QIO1
- QIO2
- QIO3
- QSCK
- D0
- D1
- D2
- (near R215) AFE0_AD8
- AFE1_AD11
- AFE1_AD10
- AFE0_AD0
- (near R215) AFE1_AD06
- MCDA0
- MCDA1
- QCS
- D3
- D4
- D5
- D6
- RF
- RD
- AFE0_AD4
- MCDA2
- MCDA3
- MCCK
- MCCDA
- D7
- D8
- D9
- D10
- D11
- D12
- DAC0
- DAC1
- RK
- AFE0_AD3
- D13
- D14
- D15
- (near R227) SPI0_SPCK
- CANTX0
- A2
- A3
- A4
- A5
- A6
- A7
- (near R227) SPI0_MOSI
- (near R227) SPI0_MISO
- TIOA11
- A8
- A9
- A10
- A11
- SDA10
- BA0
- CAS
- SDCKE
- SDCK
- SDCS
- (near R231) TWD0
- A0/NBS0
- RAS
- NWR1/NBS1
- SDWE
- WKUP1
- WKUP6
- ERASE
- CANTX1
- Date:
- PAGE:
- of
- TITLE:
- Document number:
- Revision:
- (in symbol A01-0492) +

### Library data of the parts
C200-C214 C217 C218 = A01-0246: Ceramic capacitor, SMD 0402, X7R, 16V, +/-10%; PartGroup: Capacitors,Ceramic,SMD 0402; Manufacturer: Kemet; MPN: C0402C104K4RACTU; TemperatureRange: -55 - +125 deg C; AN: A01-0246; Tolerance: 16V, +/-10%; Height: 0,5
C215 = A01-0492: Capacitor Tantalum 10V 2.2uF 10% ESR = 6 ohm; PartGroup: Capacitors,Tantalum; Manufacturer: Kemet; MPN: T494A225K010AT; TemperatureRange: - 55 C to + 125 C; AN: A01-0492; Tolerance: ±10%; Height: 1,79999995231628
C216 = A01-0360: Ceramic capacitor, SMD 0805, X7R, 10V, 10 %, (de19441); PartGroup: Capacitors,Ceramic,SMD 0805; Manufacturer: Murata; MPN: GRM21BR61A106KE19L; Tolerance: 10%; TemperatureRange: -55 - +85 deg C; AN: A01-0360; Height: 1,25
C219 = A01-0015: Ceramic capacitor, SMD 0402, NP0, 50V, +/-5%; PartGroup: Capacitors,Ceramic,SMD 0402; TemperatureRange: -55 - +125 deg C; AN: A01-0015; Value: 10p; Tolerance: 50V, +/-5%; Height: 0,550000011920929
J200 J201 = A08-1754: 1x2 pin header, 2.54mm pitch, Pin-in-Paste THM; PartGroup: Mechanical devices,Connectors,Pin headers; Manufacturer: SAMTEC; TemperatureRange: - 55 deg C to + 125 deg C; AN: A08-1754; Height: 6,09999990463257; MPN: HMTSW-102-23-F-S-237
JS200 JS201 = A08-0543: Jumper cap for 2.54mm pinheader; PartGroup: Mechanical devices,Mounting accessories,Other; Manufacturer: SAMTEC; AN: A08-0543; MPN: SNT-100-BK-G
L200-L202 = A03-0035: SMD RF inductor 0603. Z=470Ohm (@100MHz), Max R(dc)=0.65Ohm, Max current=1A; PartGroup: Inductors,EMI; Manufacturer: Murata; Tolerance: ±25%; TemperatureRange: -55°C to +125°C; AN: A03-0035; Height: 0,800000011920929; MPN: BLM18PG471SN1
R200-R202 R207-R209 R211 R213 R215-R226 R228-R230 R234 = A02-0163: RES 0.0 OHM 1/16W 0402 SMD; PartGroup: Resistors,SMD,0402 1%; Manufacturer: (n/a); MPN: RMCF0402ZT0R00; Tolerance: 1 %; TemperatureRange: -55 - +125 deg C; AN: A02-0163; Height: 0.349999994039536
R204-R206 R212 R214 R227 = A02-0178: Thick film resistor, SMD 0402, 1/16W, 1%; PartGroup: Resistors,SMD,0402 1%; TemperatureRange: -55 - +125 deg C; AN: A02-0178; Tolerance: 1 %; Height: 0,349999994039536
R231 R232 = A02-0228: Thick film resistor, SMD 0402, 1/16W, 1%; PartGroup: Resistors,SMD,0402 1%; TemperatureRange: -55ï¿½ to +125ï¿½C; AN: A02-0228; Tolerance: 1 %; Height: 0,349999994039536
R233 = A02-0929: Thick film resistor, SMD 0402, 1/16W, 1%; PartGroup: Resistors,SMD,0402 1%; TemperatureRange: -55 - +125 deg C; AN: A02-0929; Tolerance: 1 %; Height: 0,349999994039536
TP200 TP201 = A08-0004: Single SMD testpad; PartGroup: Mechanical devices,Connectors,Test points; AN: A08-0004; Value: TESTPAD; Height: 0
U200 = A06-1254: SAM 32-bit ARM Cortex-M* RISC MCU, SAMV71 Series, QFP144; PartGroup: Integrated Circuits,MCU, MPU, DSP,ARM MCU; TemperatureRange: -40Â°C to +105Â°C; AN: A06-1254; Height: 1,60000002384186

## Sheet SAMV71_Xplained_Ultra_EDBG.SchDoc: Embedded Debugger (EDBG)
size A3; Organization: ATMEL Norway; Address1: Vestre Rosten 79; Address2: N-7075 TILLER; Address3: NORWAY; DocumentNumber: A09-2407; Revision: 2; SheetNumber: 13; SheetTotal: 13; PageSetup: Record=PageOptions|CenterHorizontal=True|CenterVertical=True|PrintScale=0.73|XCorrection=1.00|YCorrection=1.00|PrintKind=1|BorderSize=5000000|LeftOffset=0|BottomOffset=0|Orientation=2|PaperLength=1000|PaperWidth=1000|Scale=100|PaperSource=7|PrintQuality=-4|MediaType=1|DitherType=10|PaperKind=A3 (297 x 420 mm)|PrintScaleMode=1
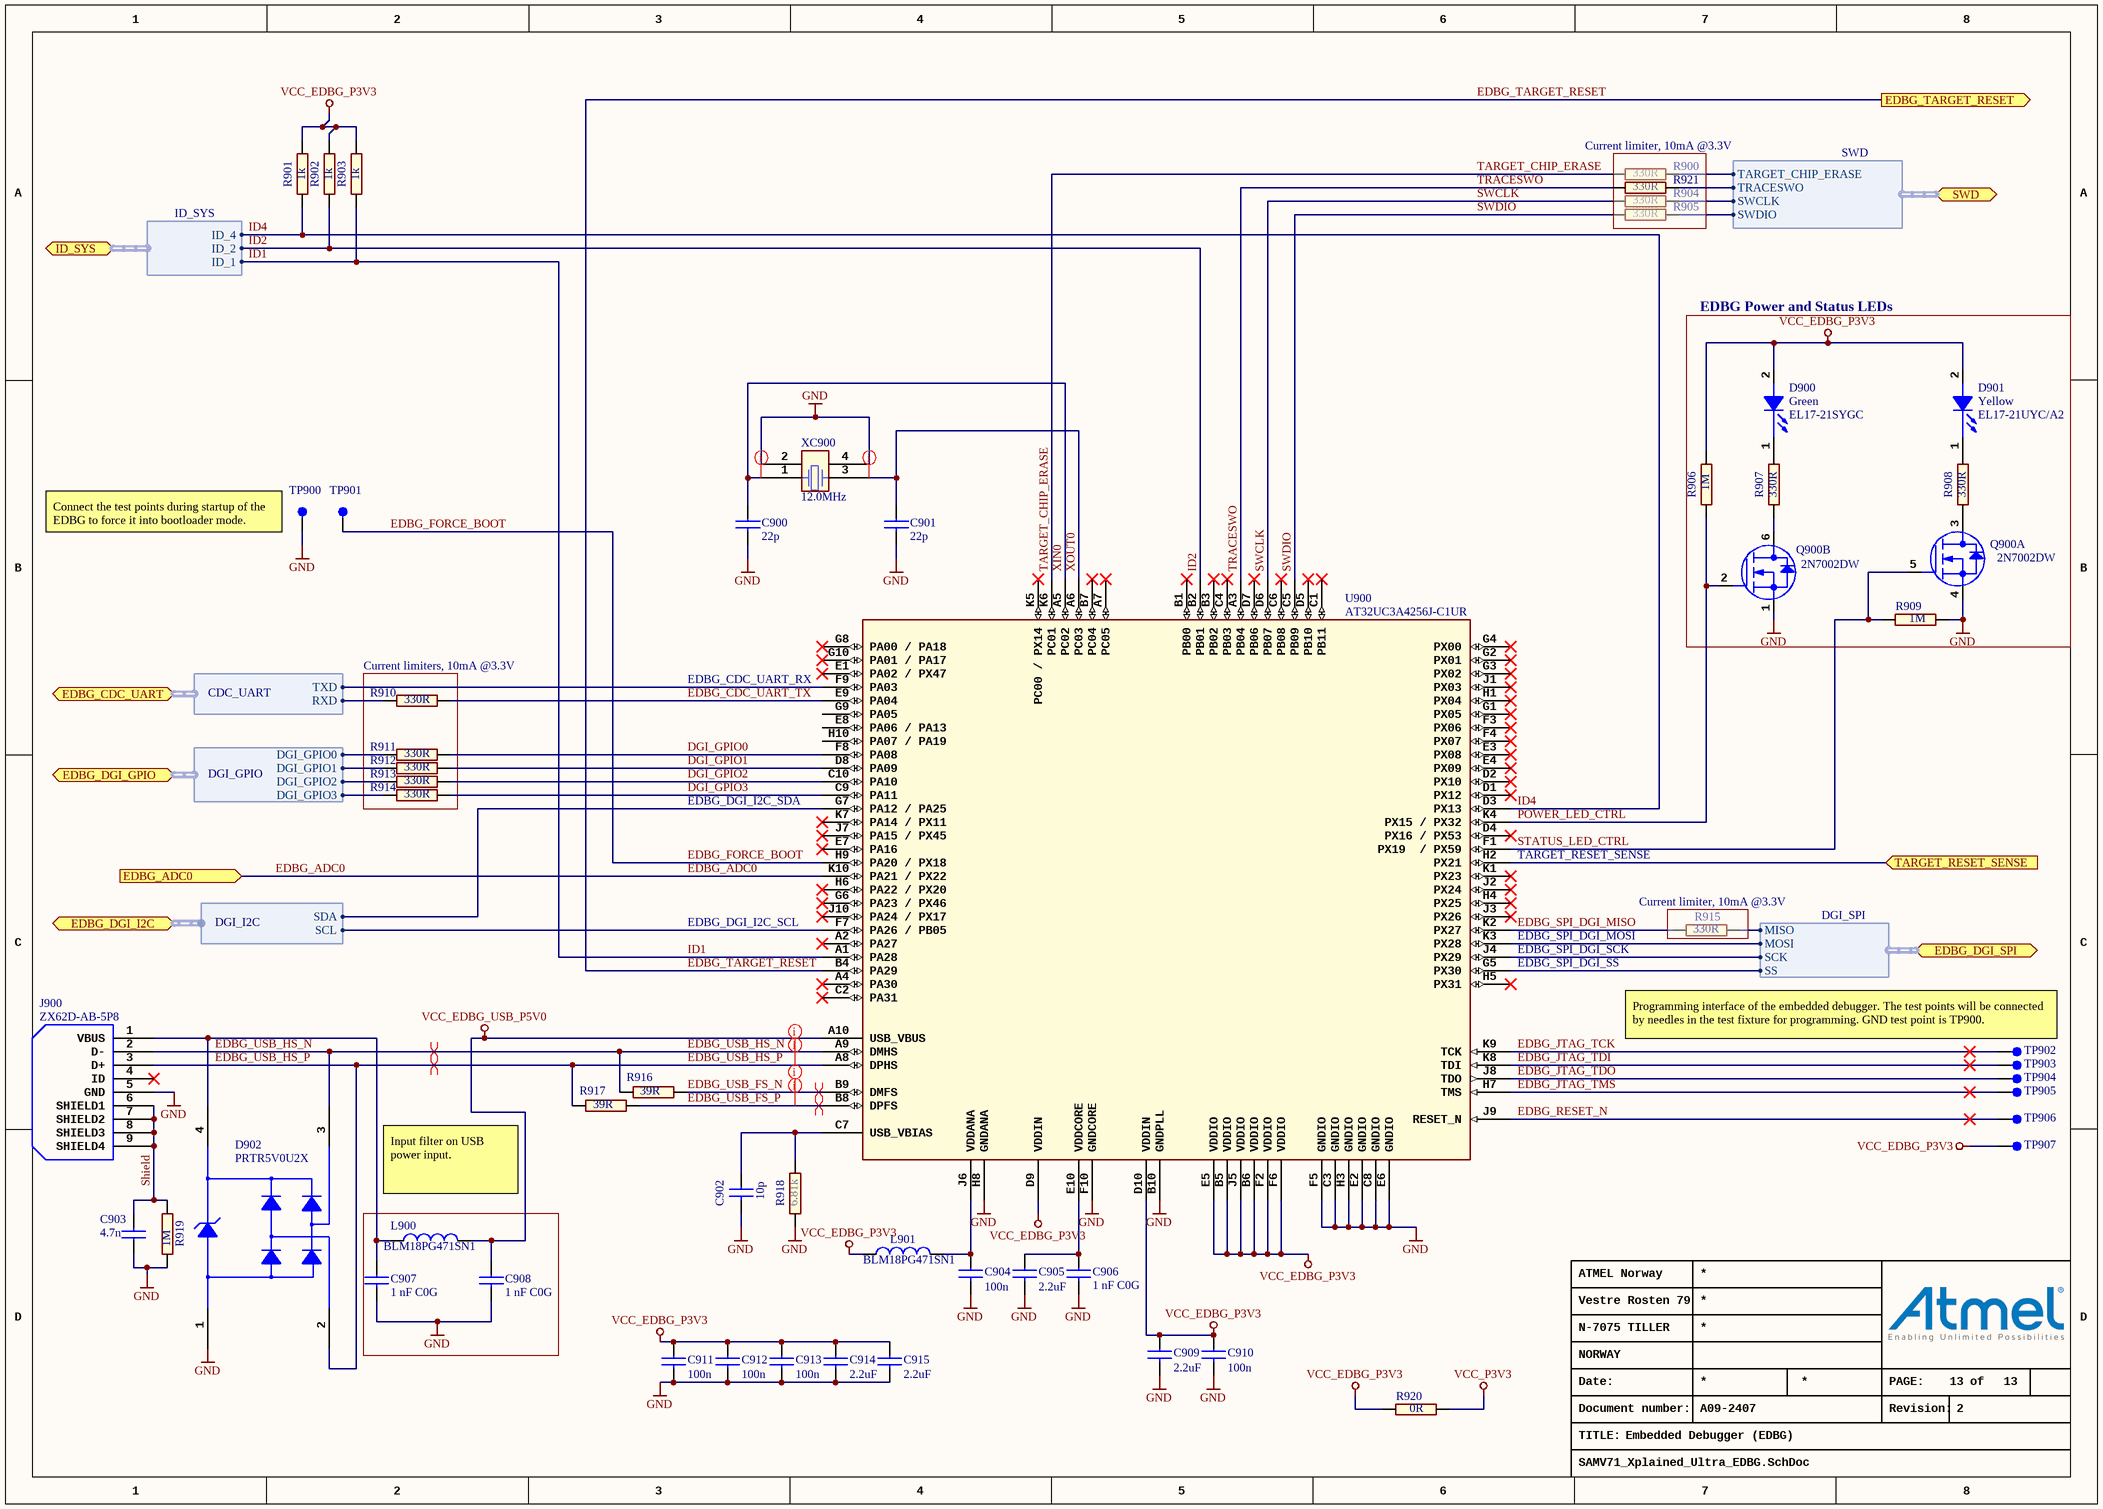
[diagram p2: SAMV71_Xplained_Ultra_EDBG.SchDoc]

### Parts
C900  22p  [AP1-00053]
C901  22p  [AP1-00053]
C902  10p  [AP1-00053]
C903  value 4.7n  [AP1-00053]  (hidden comment: CAP-NONPOL)
C904  100n  [AP1-00053]
C905  value 2.2uF  [AP1-00053]  (hidden comment: Farnell no: 1288200)
C906  1 nF C0G  [AP1-00053]
C907  1 nF C0G  [AP1-00053]
C908  1 nF C0G  [AP1-00053]
C909  value 2.2uF  [AP1-00053]  (hidden comment: Farnell no: 1288200)
C910  100n  [AP1-00053]
C911  100n  [AP1-00053]
C912  100n  [AP1-00053]
C913  100n  [AP1-00053]
C914  value 2.2uF  [AP1-00053]  (hidden comment: Farnell no: 1288200)
C915  value 2.2uF  [AP1-00053]  (hidden comment: Farnell no: 1288200)
D900  Green  value EL17-21SYGC  [AP4-00013]
D901  Yellow  value EL17-21UYC/A2  [AP4-00013]
D902  PRTR5V0U2X  [AP4-00001]
J900  value ZX62D-AB-5P8  [AP8-00852]  (hidden comment: 2,000 pieces per reel)
L900  BLM18PG471SN1  [AP3-00005]
L901  BLM18PG471SN1  [AP3-00005]
Q900  value 2N7002DW  [AP5-00001]  (hidden comment: Same as 2N7002 but with two MOSFETs in one package)  (parts A,B of 2)
R900  value 330R  [AP2-00000]  (hidden comment: R2)
R901  value 1k  [AP2-00000]  (hidden comment: R2)
R902  value 1k  [AP2-00000]  (hidden comment: R2)
R903  value 1k  [AP2-00000]  (hidden comment: R2)
R904  value 330R  [AP2-00000]  (hidden comment: R2)
R905  value 330R  [AP2-00000]  (hidden comment: R2)
R906  value 1M  [AP2-00000]  (hidden comment: R2)
R907  value 330R  [AP2-00000]  (hidden comment: R2)
R908  value 330R  [AP2-00000]  (hidden comment: R2)
R909  value 1M  [AP2-00000]  (hidden comment: R2)
R910  value 330R  [AP2-00000]  (hidden comment: R2)
R911  value 330R  [AP2-00000]  (hidden comment: R2)
R912  value 330R  [AP2-00000]  (hidden comment: R2)
R913  value 330R  [AP2-00000]  (hidden comment: R2)
R914  value 330R  [AP2-00000]  (hidden comment: R2)
R915  value 330R  [AP2-00000]  (hidden comment: R2)
R916  value 39R  [AP2-00011]  (hidden comment: R2)
R917  value 39R  [AP2-00011]  (hidden comment: R2)
R918  value 6.81k  [AP2-00011]  (hidden comment: R2)
R919  value 1M  [AP2-00011]  (hidden comment: R2)
R920  value 0R  [AP2-00000]  (hidden comment: R2)
R921  value 330R  [AP2-00000]  (hidden comment: R2)
TP900  TESTPOINT  [AP8-00010]  (value not drawn)  (no BOM)
TP901  TESTPOINT  [AP8-00010]  (value not drawn)  (no BOM)
TP902  TESTPOINT  [AP8-00010]  (value not drawn)  (no BOM)
TP903  TESTPOINT  [AP8-00010]  (value not drawn)  (no BOM)
TP904  TESTPOINT  [AP8-00010]  (value not drawn)  (no BOM)
TP905  TESTPOINT  [AP8-00010]  (value not drawn)  (no BOM)
TP906  TESTPOINT  [AP8-00010]  (value not drawn)  (no BOM)
TP907  TESTPOINT  [AP8-00010]  (value not drawn)  (no BOM)
U900  value AT32UC3A4256J-C1UR  [AP6-00206]  (hidden comment: 100 ball VFBGA)
XC900  12.0MHz  [AP7-00039]

### Blocks framed on the sheet
EDBG Power and Status LEDs: D900 D901 Q900 R906-R909
Current limiters, 10mA @3.3V: R910-R914

### Ports
EDBG_ADC0 (in), EDBG_CDC_UART (harness CDC_UART), EDBG_DGI_GPIO (harness DGI_GPIO), EDBG_DGI_I2C (harness DGI_I2C), EDBG_DGI_SPI (harness DGI_SPI), EDBG_TARGET_RESET (out), ID_SYS (harness ID_SYS), SWD (harness SWD), TARGET_RESET_SENSE (in)

### Harnesses
CDC_UART: TXD, RXD
DGI_SPI: MISO, MOSI, SCK, SS
DGI_GPIO: DGI_GPIO0, DGI_GPIO1, DGI_GPIO2, DGI_GPIO3
ID_SYS: ID_1, ID_2, ID_4
SWD: SWCLK, SWDIO, TARGET_CHIP_ERASE, TRACESWO
DGI_I2C: SCL, SDA

### Nets
GND: C900.2 C901.2 C902.2 C903.1 C904.2 C905.2 C906.2 C907.2 C908.2 C909.2 C910.2 C911.2 C912.2 C913.2 C914.2 C915.2 D902.1(GND) J900.5(GND) Q900.1(S2) Q900.4(S1) R909.1 R918.1 R919.1 TP900.1 U900.B10(GNDPLL) U900.C3(GNDIO) U900.C8(GNDIO) U900.E2(GNDIO) U900.E6(GNDIO) U900.F5(GNDIO) U900.F10(GNDCORE) U900.H3(GNDIO) U900.H8(GNDANA) XC900.2 XC900.4
VCC_EDBG_P3V3: C909.1 C910.1 C911.1 C912.1 C913.1 C914.1 C915.1 D900.2(ANODE) D901.2(ANODE) L901.1 R901.2 R902.2 R903.2 R906.2 R920.1 TP907.1 U900.B5(VDDIO) U900.B6(VDDIO) U900.D9(VDDIN) U900.D10(VDDIN) U900.E5(VDDIO) U900.F2(VDDIO) U900.F6(VDDIO) U900.J5(VDDIO)
VCC_EDBG_USB_P5V0: C908.1 L900.2 U900.A10(USB_VBUS)
VCC_P3V3: R920.2
DGI_GPIO0: R911.2 U900.F8(PA08)
DGI_GPIO1: R912.2 U900.D8(PA09)
DGI_GPIO2: R913.2 U900.C10(PA10)
DGI_GPIO3: R914.2 U900.C9(PA11)
EDBG_ADC0: U900.K10(PA21_/_PX22) ; port EDBG_ADC0
EDBG_CDC_UART_TX: R910.2 U900.E9(PA04)
EDBG_FORCE_BOOT: TP901.1 U900.H9(PA20_/_PX18)
EDBG_JTAG_TCK: TP902.1 U900.K9(TCK)
EDBG_JTAG_TDI: TP903.1 U900.K8(TDI)
EDBG_JTAG_TDO: TP904.1 U900.J8(TDO)
EDBG_JTAG_TMS: TP905.1 U900.H7(TMS)
EDBG_RESET_N: TP906.1 U900.J9(RESET_N)
EDBG_SPI_DGI_MISO: R915.1 U900.K2(PX27)
EDBG_TARGET_RESET: U900.B4(PA29) ; port EDBG_TARGET_RESET
EDBG_USB_FS_N: R916.2 U900.B9(DMFS)
EDBG_USB_FS_P: R917.2 U900.B8(DPFS)
EDBG_USB_HS_N: D902.3(I/O_2) J900.2(D-) R916.1 U900.A9(DMHS)
EDBG_USB_HS_P: D902.2(I/O_1) J900.3(D+) R917.1 U900.A8(DPHS)
ID1: R903.1 U900.A1(PA28) ; port ID_SYS.ID_1
ID2: R902.1 U900.B2(PB01) ; port ID_SYS.ID_2
ID4: R901.1 U900.D3(PX13) ; port ID_SYS.ID_4
PA02: R914.1 ; port EDBG_DGI_GPIO.DGI_GPIO3
PA03: U900.G7(PA12_/_PA25) ; port EDBG_DGI_I2C.SDA
PA04: U900.F7(PA26_/_PB05) ; port EDBG_DGI_I2C.SCL
PA09: R911.1 ; port EDBG_DGI_GPIO.DGI_GPIO0
PA21: R910.1 ; port EDBG_CDC_UART.RXD
PA23: R912.1 ; port EDBG_DGI_GPIO.DGI_GPIO1
PB04: U900.F9(PA03) ; port EDBG_CDC_UART.TXD
PB05: R921.2 ; port SWD.TRACESWO
PB06_SWDIO: R905.2 ; port SWD.SWDIO
PB07_SWCLK: R904.2 ; port SWD.SWCLK
PB12: R900.2 ; port SWD.TARGET_CHIP_ERASE
PD12: U900.G5(PX30) ; port EDBG_DGI_SPI.SS
PD20: R915.2 ; port EDBG_DGI_SPI.MISO
PD21: U900.K3(PX28) ; port EDBG_DGI_SPI.MOSI
PD28: R913.1 ; port EDBG_DGI_GPIO.DGI_GPIO2
POWER_LED_CTRL: Q900.2(G2) R906.1 U900.K4(PX15_/_PX32)
Shield: C903.2 J900.6(SHIELD1) J900.7(SHIELD2) J900.8(SHIELD3) J900.9(SHIELD4) R919.2
STATUS_LED_CTRL: Q900.5(G1) R909.2 U900.F1(PX19__/_PX59)
SWCLK: R904.1 U900.D6(PB07)
SWDIO: R905.1 U900.C5(PB09)
TARGET_CHIP_ERASE: R900.1 U900.K6(PC01)
TARGET_RESET: U900.H2(PX21) ; port TARGET_RESET_SENSE
TRACESWO: R921.1 U900.A3(PB04)
XIN0: C900.1 U900.A5(PC02) XC900.1
XOUT0: C901.1 U900.A6(PC03) XC900.3
NetC902_1: C902.1 R918.2 U900.C7(USB_VBIAS)
NetC904_1: C904.1 L901.2 U900.J6(VDDANA)
NetC905_1: C905.1 C906.1 U900.E10(VDDCORE)
NetC907_1: C907.1 D902.4(VCC) J900.1(VBUS) L900.1
NetD900_1: D900.1(CATHODE) R907.2
NetD901_1: D901.1(CATHODE) R908.2
NetQ900_3: Q900.3(D1) R908.1
NetQ900_6: Q900.6(D2) R907.1
NetR206_1: U900.J4(PX29) ; port EDBG_DGI_SPI.SCK

Not connected (* = marked no-connect by the designer): J900 4(ID)*; U900 A2(PA27)* A4(PA30)* A7(PC05)* B1(PB00)* B3(PB02)* B7(PC04)* C1(PB11)* C2(PA31)* C4(PB03)* C6(PB08)* D1(PX12)* D2(PX10)* D4(PX16_/_PX53)* D5(PB10)* D7(PB06)* E1(PA02_/_PX47)* E3(PX08)* E4(PX09)* E7(PA16)* E8(PA06_/_PA13) F3(PX06)* F4(PX07)* G1(PX05)* G2(PX01)* G3(PX02)* G4(PX00)* G6(PA23_/_PX46)* G8(PA00_/_PA18)* G9(PA05) G10(PA01_/_PA17)* H1(PX04)* H4(PX25)* H5(PX31)* H6(PA22_/_PX20)* H10(PA07_/_PA19) J1(PX03)* J2(PX24)* J3(PX26)* J7(PA15_/_PX45)* J10(PA24_/_PX17)* K1(PX23)* K5(PC00_/_PX14)* K7(PA14_/_PX11)*

### Layout directives
differential pair: EDBG_USB_FS_N, EDBG_USB_FS_P, EDBG_USB_HS_N, EDBG_USB_HS_P
rule Assembly Testpoint Usage [Testpoint - Not Allowed    Multiple - Not Allowed]; rule Fabrication Testpoint Usage [Testpoint - Not Allowed    Multiple - Not Allowed]: EDBG_USB_FS_N, EDBG_USB_FS_P, EDBG_USB_HS_N, EDBG_USB_HS_P, XIN0, XOUT0

### Notes on the sheet
- Current limiter, 10mA @3.3V
- (near TP900) Connect the test points during startup of the EDBG to force it into bootloader mode.
- EDBG_CDC_UART_RX
- EDBG_DGI_I2C_SDA
- (near U900) TARGET_RESET_SENSE
- (near R915) Current limiter, 10mA @3.3V
- EDBG_DGI_I2C_SCL
- EDBG_SPI_DGI_MOSI
- EDBG_SPI_DGI_SCK
- (near U900) EDBG_SPI_DGI_SS
- (near TP902) Programming interface of the embedded debugger. The test points will be connected by needles in the test fixture for programming. GND test point is TP900.
- Input filter on USB power input.
- Date:
- PAGE:
- of
- TITLE:
- Document number:
- Revision:

### Library data of the parts
C900 C901 = A01-0019: Ceramic capacitor, SMD 0402, NP0, 50V, +/-5%; PartGroup: Capacitors,Ceramic,SMD 0402; TemperatureRange: -55 - +125 deg C; AN: A01-0019; Value: 22p; Tolerance: 50V, +/-5%; Height: 0,550000011920929
C902 = A01-0015: as C219 on sheet SAMV71_Xplained_Ultra_Target_MCU; AN: A01-0015; Value: 10p; Tolerance: 50V, +/-5%; Height: 0,550000011920929
C903 = A01-0046: Ceramic capacitor, SMD 0402, X7R, 25V, +/-10%; PartGroup: Capacitors,Ceramic,SMD 0402; TemperatureRange: -55 - +125 deg C; AN: A01-0046; Tolerance: 25V, +/-10%; Height: 0.550000011920929
C904 C910-C913 = A01-0246: as C200 on sheet SAMV71_Xplained_Ultra_Target_MCU; AN: A01-0246; Value: 100n; Tolerance: 16V, +/-10%; Height: 0,5
C905 C909 C914 C915 = A01-0300: Ceramic capacitor, SMD 0402, X5R, 6.3V, +/-20%; PartGroup: Capacitors,Ceramic,SMD 0402; Manufacturer: Kemet; MPN: C0402C225M9PAC; Tolerance: ±20%; TemperatureRange: -55°C to +85°C; AN: A01-0300; Height: 0,5
C906-C908 = A01-0321: Ceramic capacitor, SMD 0402, C0G, 50V, +/-5%; PartGroup: Capacitors,Ceramic,SMD 0402; Manufacturer: Murata; MPN: GRM1555C1H102JA01D; Tolerance: 5%; AN: A01-0321; Value: 1 nF C0G
D900 = A10-0018: LED, Green, Wave length=575nm, SMD 0805, ±70°; PartGroup: Opto,LEDs,SMD; Manufacturer: Everlight; TemperatureRange: -40 - +85 deg C; AN: A10-0018; Height: 1,10000002384186; MPN: EL17-21SYGC
D901 = A10-0019: LED, Yellow, Wave length=591nm, SMD 0805, ±70°; PartGroup: Opto,LEDs,SMD; Manufacturer: Everlight; MPN: 17-21UYC/S530-A3/TR8; TemperatureRange: -40 to +85 deg C; AN: A10-0019; Height: 1,10000002384186
D902 = A06-0236: Double rail-to-rail USB ESD protection diode; OrcadPartType: Integrated Circuits&Special function&Protection; Manufacturer: Philips; TemperatureRange: -40 to +85 C; AN: A06-0236; Value: PRTR5V0U2X; PartType: Buy; Height: 1,10000002384186; MPN: PRTR5V0U2X
J900 = A08-2112: Micro USB AB Connector, Standard SMT + DIP; PartGroup: Mechanical devices,Connectors,USB; AN: A08-2112; Height: 2,79999995231628
L900 L901 = A03-0035: as L200 on sheet SAMV71_Xplained_Ultra_Target_MCU; AN: A03-0035; Value: BLM18PG471SN1; Height: 0,800000011920929; MPN: BLM18PG471SN1
Q900 = A05-0051: Dual N-Channel MOSFET, 60V, 115mA cont,RDS(ON) < 7.5 Ohm @50mA@5V, SOT-363; PartGroup: Transistors,Small signal FET,SMD; Manufacturer: Fairchild; TemperatureRange: -65 to 150 deg C; AN: A05-0051; Height: 1,10000002384186; MPN: 2N7002DW
R900 R904 R905 R907 R908 R910-R915 R921 = A02-0200: Thick film resistor, SMD 0402, 1/16W, 1%; PartGroup: Resistors,SMD,0402 1%; TemperatureRange: -55 - +125 deg C; AN: A02-0200; Tolerance: 1 %
  R900 R904 R905 R910-R915 R921: Height: 0,349999994039536
  R907 R908: Height: 0.349999994039536
R901-R903 = A02-0212: Thick film resistor, SMD 0402, 1/16W, 1%; PartGroup: Resistors,SMD,0402 1%; TemperatureRange: -55 - +125 deg C; AN: A02-0212; Tolerance: 1 %; Height: 0.349999994039536
R906 R909 R919 = A02-0284: Thick film resistor, SMD 0402, 1/16W, 1%; PartGroup: Resistors,SMD,0402 1%; Manufacturer: KOA; MPN: RK73H1ETTP1004F; TemperatureRange: -55 - +125 deg C; AN: A02-0284; Tolerance: 1 %
  R906 R909: Height: 0.349999994039536
  R919: Height: 0,349999994039536
R916 R917 = A02-0178: as R204 on sheet SAMV71_Xplained_Ultra_Target_MCU; AN: A02-0178; Tolerance: 1 %; Height: 0,349999994039536
R918 = A02-0539: Thick film resistor, SMD 0402, 1/16W, 1%; PartGroup: Resistors,SMD,0402 1%; TemperatureRange: -55 - +125 deg C; AN: A02-0539; Tolerance: 1%; Height: 0,349999994039536
R920 = A02-0163: Thick film resistor, SMD 0402, 1/16W, 1%; PartGroup: Resistors,SMD,0402 1%; TemperatureRange: -55 - +125 deg C; AN: A02-0163; Tolerance: 1 %; Height: 0.349999994039536
TP900-TP907 = A08-0004: as TP200 on sheet SAMV71_Xplained_Ultra_Target_MCU; AN: A08-0004; Height: 0
U900 = A06-0736: AVR 32-bit RISC MCU; PartGroup: Integrated Circuits,MCU, MPU, DSP,AVR MCU; Manufacturer: ATMEL; TemperatureRange: -40 to +85 deg C; AN: A06-0736; Height: 1; MPN: AT32UC3A4256J-C1UR
XC900 = A07-0042: Fox FQ5032B 12.0MHz SMD crystal 738B-12; PartGroup: Frequency devices,Crystals,SMD; Manufacturer: Fox  Electronics; MPN: FQ5032B-12-C-C-C-200-1; Tolerance: 30PPM; AN: A07-0042; Value: 12.0MHz; Height: 1,20000004768372